# Altium schematic sheet Current-measurement.SchDoc
size A4
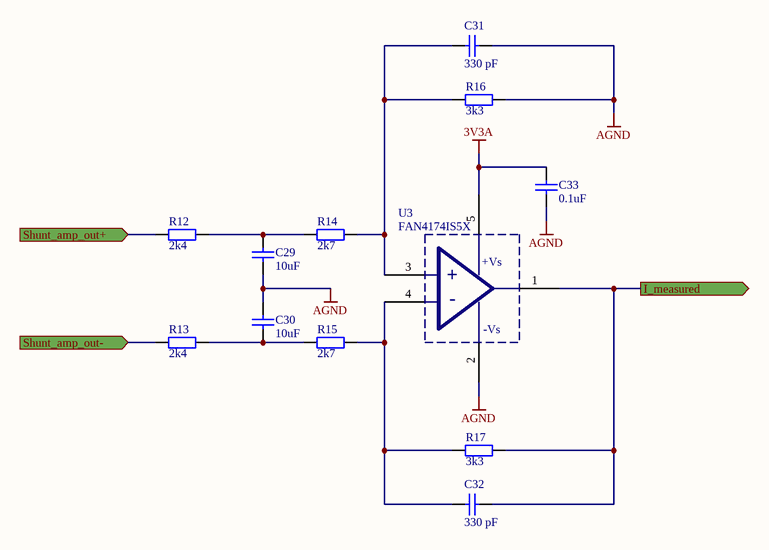
[diagram p0: Current-measurement.SchDoc]

## Parts
C29  10uF  [FP_0603_CAP_080]
C30  10uF  [FP_0603_CAP_080]
C31  330 pF  [FP_0603_CAP_080]
C32  330 pF  [FP_0603_CAP_080]
C33  0.1uF  [FP_0603_CAP_080]
R12  2k4  [FP_0603_RES]
R13  2k4  [FP_0603_RES]
R14  2k7  [FP_0603_RES]
R15  2k7  [FP_0603_RES]
R16  3k3  [FP_0603_RES]
R17  3k3  [FP_0603_RES]
U3  FAN4174IS5X  [SOT-23-5]

## Ports
I_measured (out), Shunt_amp_out+ (in), Shunt_amp_out- (in)

## Nets
3V3A: C33.1 U3.5(+Vs)
AGND: C29.2 C30.1 C31.2 C33.2 R16.2 U3.2(-Vs)
I_measured: C32.2 R17.2 U3.1(OUT) ; port I_measured
Shunt_amp_out+: R12.1 ; port Shunt_amp_out+
Shunt_amp_out-: R13.1 ; port Shunt_amp_out-
NetC29_1: C29.1 R12.2 R14.1
NetC30_2: C30.2 R13.2 R15.1
NetC31_1: C31.1 R14.2 R16.1 U3.3(+IN)
NetC32_1: C32.1 R15.2 R17.1 U3.4(-IN)

## Notes on the sheet
- (in symbol FAN4174IS5X) +; -

## Library data of the parts
C29-C33 = CAP: Capacitor
  C29 C30: Value: 10uF
  C31 C32: Value: 330 pF
  C33: Value: 0.1uF
R12-R17 = RES: Resistor
  R12 R13: Value: 2k4
  R14 R15: Value: 2k7
  R16 R17: Value: 3k3
U3 = FAN4174IS5X: OrderCode: 671-1166; CompType: FAN4174IS5X; Distributor: RS components; Package: SOT-23-5